# EAGLE schematic schem (EAGLE 9.6.2)
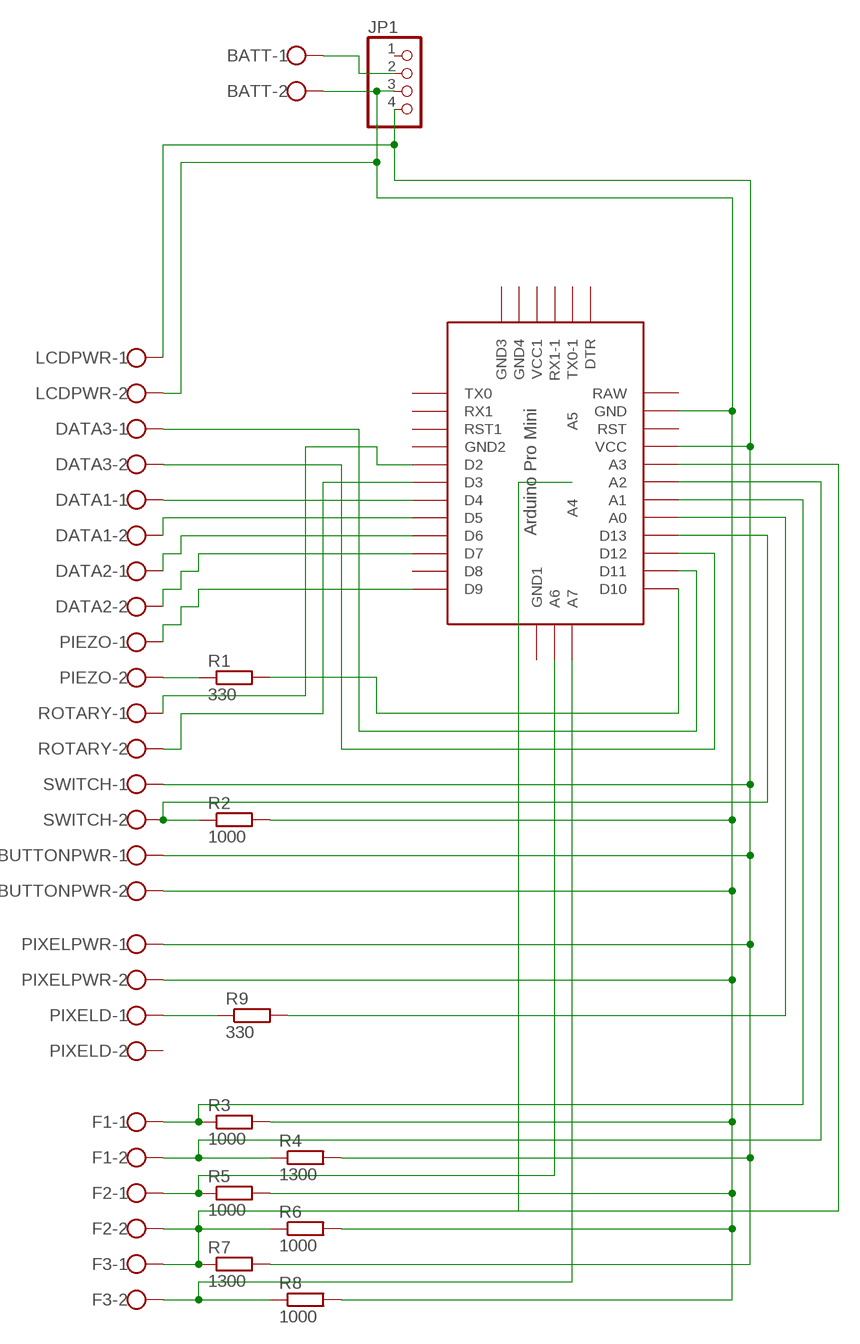
[diagram p0: schematic, sheet 1]

## Parts
BATT  W237-102  [W237-102]
BUTTONPWR  W237-102  [W237-102]
DATA1  W237-102  [W237-102]
DATA2  W237-102  [W237-102]
DATA3  W237-102  [W237-102]
F1  W237-102  [W237-102]
F2  W237-102  [W237-102]
F3  W237-102  [W237-102]
JP1  PINHD-1X4  [1X04]
LCDPWR  W237-102  [W237-102]
PIEZO  W237-102  [W237-102]
PIXELD  W237-102  [W237-102]
PIXELPWR  W237-102  [W237-102]
R1  330  R-EU_0204/7  [0204/7]
R2  1000  R-EU_0204/7  [0204/7]
R3  1000  R-EU_0204/7  [0204/7]
R4  1300  R-EU_0204/7  [0204/7]
R5  1000  R-EU_0204/7  [0204/7]
R6  1000  R-EU_0204/7  [0204/7]
R7  1300  R-EU_0204/7  [0204/7]
R8  1000  R-EU_0204/7  [0204/7]
R9  330  R-EU_0207/10  [0207/10]
ROTARY  W237-102  [W237-102]
SWITCH  W237-102  [W237-102]
U$1  ABK-PRO-MINI  [ABK-PRO-MINI]

## Nets
N$1: BUTTONPWR.1 JP1.4 LCDPWR.1 PIXELPWR.1 R4.2 R7.2 SWITCH.1 U$1.VCC
N$2: BATT.2 BUTTONPWR.2 JP1.3 LCDPWR.2 PIXELPWR.2 R2.2 R3.2 R5.2 R6.2 R8.2 U$1.GND
N$3: BATT.1 JP1.2
N$4: DATA2.1 U$1.D6
N$5: DATA3.1 U$1.D11
N$6: DATA3.2 U$1.D12
N$7: DATA1.1 U$1.D4
N$8: DATA1.2 U$1.D5
N$9: DATA2.2 U$1.D7
N$10: PIEZO.1 U$1.D9
N$11: PIEZO.2 R1.1
N$12: R1.2 U$1.D10
N$13: ROTARY.1 U$1.D2
N$14: ROTARY.2 U$1.D3
N$15: F1.1 R3.1 U$1.A1
N$16: R2.1 SWITCH.2 U$1.D13
N$17: R9.2 U$1.A0
N$18: F1.2 R4.1 U$1.A2
N$19: F2.1 R5.1 U$1.A6
N$20: F2.2 F3.1 R6.1 R7.1 U$1.A3 U$1.A4
N$22: F3.2 R8.1 U$1.A7
N$23: PIXELD.1 R9.1
Unconnected: JP1.1 PIXELD.2 U$1.A5 U$1.D8 U$1.DTR U$1.GND1(GND2) U$1.GND2(GND3) U$1.GND3(GND4) U$1.GND4(GND1) U$1.RAW U$1.RST U$1.RST1 U$1.RX1 U$1.RX1-1 U$1.TX0 U$1.TX0-1 U$1.VCC1

## Library data of the parts
BATT BUTTONPWR DATA1-DATA3 F1-F3 LCDPWR PIEZO PIXELD PIXELPWR ROTARY SWITCH = con-wago-500:W237-102: WAGO SCREW CLAMP; MPN: 237-102; OC_FARNELL: unknown; OC_NEWARK: 70K9898
JP1 = pinhead:PINHD-1X4: PIN HEADER
R1-R9 = rcl:R-EU_: RESISTOR, European symbol; SPICEPREFIX: R
U$1 = Arduino-clone:ABK-PRO-MINI: ABK Pro-Mini Arduino Clone